# EAGLE schematic untitledV2 (EAGLE 6.6.0)
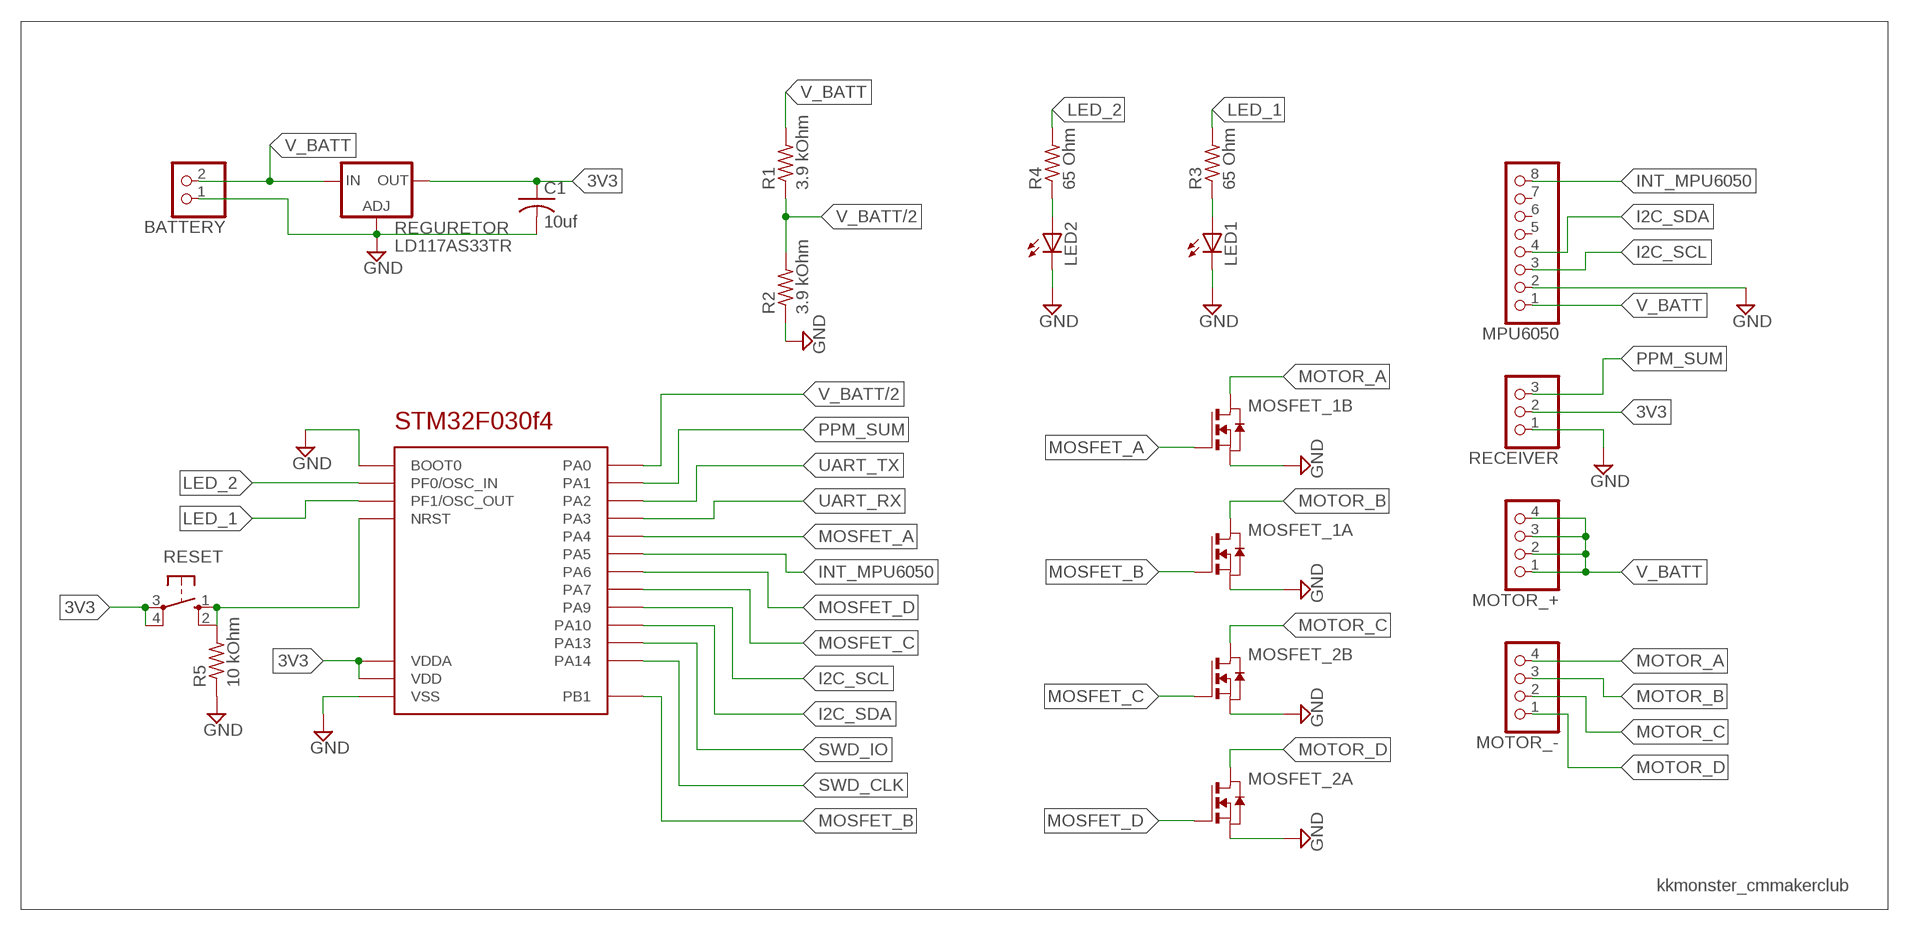
[diagram p0: schematic, sheet 1]

## Parts
BATTERY  PINHD-1X2  [1X02]
C1  10uf  C-USC1206  [C1206]
LED1  LEDSMT1206  [1206]
LED2  LEDSMT1206  [1206]
MOSFET_1  DMN3024LSD  [SO8]
MOSFET_2  DMN3024LSD  [SO8]
MOTOR_+  PINHD-1X4  [1X04]
MOTOR_-  PINHD-1X4  [1X04]
MPU6050  PINHD-1X8  [1X08]
R1  3.9 kOhm  R-US_R1206  [R1206]
R2  3.9 kOhm  R-US_R1206  [R1206]
R3  65 Ohm  R-US_R1206  [R1206]
R4  65 Ohm  R-US_R1206  [R1206]
R5  10 kOhm  R-US_R1206  [R1206]
RECEIVER  PINHD-1X3  [1X03]
REGURETOR  LD117AS33TR  [SOT223]
RESET  10-XX  [B3F-10XX]
U$1  STM32F030X4  [TSSOP20]

## Nets
3V3: C1.1 RECEIVER.2 REGURETOR.4(OUT) RESET.3(P) RESET.4(P1) U$1.P$5(VDDA) U$1.P$16(VDD)
GND: BATTERY.1 C1.2 LED1.C LED2.C MOSFET_1.1(A:S) MOSFET_1.3(B:S) MOSFET_2.1(A:S) MOSFET_2.3(B:S) MPU6050.2 R2.1 R5.1 RECEIVER.1 REGURETOR.1(ADJ) U$1.P$1(BOOT0) U$1.P$15(VSS)
I2C_SCL: MPU6050.3 U$1.P$17(PA9)
I2C_SDA: MPU6050.4 U$1.P$18(PA10)
INT_MPU6050: MPU6050.8 U$1.P$11(PA5)
LED_1: R3.2 U$1.P$3(PF1/OSC_OUT)
LED_2: R4.2 U$1.P$2(PF0/OSC_IN)
MOSFET_A: MOSFET_1.4(B:G) U$1.P$10(PA4)
MOSFET_B: MOSFET_1.2(A:G) U$1.P$14(PB1)
MOSFET_C: MOSFET_2.4(B:G) U$1.P$13(PA7)
MOSFET_D: MOSFET_2.2(A:G) U$1.P$12(PA6)
MOTOR_A: MOSFET_1.5(B:D) MOSFET_1.6(B:D) MOTOR_-.4
MOTOR_B: MOSFET_1.7(A:D) MOSFET_1.8(A:D) MOTOR_-.3
MOTOR_C: MOSFET_2.5(B:D) MOSFET_2.6(B:D) MOTOR_-.2
MOTOR_D: MOSFET_2.7(A:D) MOSFET_2.8(A:D) MOTOR_-.1
N$4: LED2.A R4.1
N$5: LED1.A R3.1
N$6: R5.2 RESET.1(S) RESET.2(S1) U$1.P$4(NRST)
PPM_SUM: RECEIVER.3 U$1.P$7(PA1)
SWD_CLK: U$1.P$20(PA14)
SWD_IO: U$1.P$19(PA13)
UART_RX: U$1.P$9(PA3)
UART_TX: U$1.P$8(PA2)
V_BATT: BATTERY.2 MOTOR_+.1 MOTOR_+.2 MOTOR_+.3 MOTOR_+.4 MPU6050.1 R1.2 REGURETOR.3(IN)
V_BATT/2: R1.1 R2.2 U$1.P$6(PA0)
Unconnected: MPU6050.5 MPU6050.6 MPU6050.7

## Notes on the sheet
- kkmonster_cmmakerclub

## Library data of the parts
BATTERY = pinhead:PINHD-1X2: PIN HEADER
C1 = resistor:C-US: CAPACITOR, American symbol
LED1 LED2 = led:LED: LED OSRAM: - CHIPLED LG R971, LG N971, LY N971, LG Q971, LY Q971, LO R971, LY R971 LH N974, LH R974 LS Q976, LO Q976, LY Q976 LO Q996 - Hyper CHIPLED LW Q18S LB Q993, LB Q99A, LB R99A - SideLED LS A670, LO A670, LY A670, LG A670, LP A670 LB A673, LV A673, LT A673, LW A673 LH A674 LY A675 LS A676, LA A676, LO A676, LY A676, LW A676 LS A679, LY A679, LG A679 - Hyper Micro SIDELED® LS Y876, LA Y876, LO Y876, LY Y876 LT Y87S - SmartLED LW L88C, LW L88S LB L89C, LB L89S, LG L890 LS L89K, LO L89K, LY L89K LS L896, LA L896, LO L896, LY L896 - TOPLED LS T670, LO T670, LY T670, LG T670, LP T670 LSG T670, LSP T670, LSY T670, LOP T670, LYG T670 LG T671, LOG T671, LSG T671 LB T673, LV T673, LT T673, LW T673 LH T674 LS T676, LA T676, LO T676, LY T676, LB T676, LH T676, LSB T676, LW T676 LB T67C, LV T67C, LT T67C, LS T67K, LO T67K, LY T67K, LW E67C LS E67B, LA E67B, LO E67B, LY E67B, LB E67C, LV E67C, LT E67C LW T67C LS T679, LY T679, LG T679 LS T770, LO T770, LY T770, LG T770, LP T770 LB T773, LV T773, LT T773, LW T773 LH T774 LS E675, LA E675, LY E675, LS T675 LS T776, LA T776, LO T776, LY T776, LB T776 LHGB T686 LT T68C, LB T68C - Hyper Mini TOPLED® LB M676 - Mini TOPLED Santana® LG M470 LS M47K, LO M47K, LY M47K Source: http://www.osram.convergy.de LUXEON: - LUMILED® LXK2-PW12-R00, LXK2-PW12-S00, LXK2-PW14-U00, LXK2-PW14-V00 LXK2-PM12-R00, LXK2-PM12-S00, LXK2-PM14-U00 LXK2-PE12-Q00, LXK2-PE12-R00, LXK2-PE12-S00, LXK2-PE14-T00, LXK2-PE14-U00 LXK2-PB12-K00, LXK2-PB12-L00, LXK2-PB12-M00, LXK2-PB14-N00, LXK2-PB14-P00, LXK2-PB14-Q00 LXK2-PR12-L00, LXK2-PR12-M00, LXK2-PR14-Q00, LXK2-PR14-R00 LXK2-PD12-Q00, LXK2-PD12-R00, LXK2-PD12-S00 LXK2-PH12-R00, LXK2-PH12-S00 LXK2-PL12-P00, LXK2-PL12-Q00, LXK2-PL12-R00 Source: www.luxeon.com KINGBRIGHT: KA-3528ASYC Source: www.kingbright.com
MOSFET_1 MOSFET_2 = zetex:DMN3024LSD: 30V DUAL N-CHANNEL ENHANCEMENT MODE MOSFET Source: Data sheet <http://www.diodes.com/datasheets/DMN3024LSD.pdf>; OC_FARNELL: unknown; OC_NEWARK: unknown
MOTOR_+ MOTOR_- = pinhead:PINHD-1X4: PIN HEADER
MPU6050 = pinhead:PINHD-1X8: PIN HEADER
R1-R5 = rcl:R-US_: RESISTOR, American symbol
RECEIVER = pinhead:PINHD-1X3: PIN HEADER
REGURETOR = v-reg:LD117A?*: Low drop fixed and adjustable positive voltage regulators 1 A Source: http://www.st.com/stonline/products/literature/ds/7194/ld1117axx.pdf
RESET = switch-omron:10-XX: OMRON SWITCH; MPN: B3F-1000; OC_FARNELL: 176432; OC_NEWARK: 36M3542
U$1 = stm32:STM32F030X4